# EAGLE design 1Sens+lowPass (EAGLE 6.4)
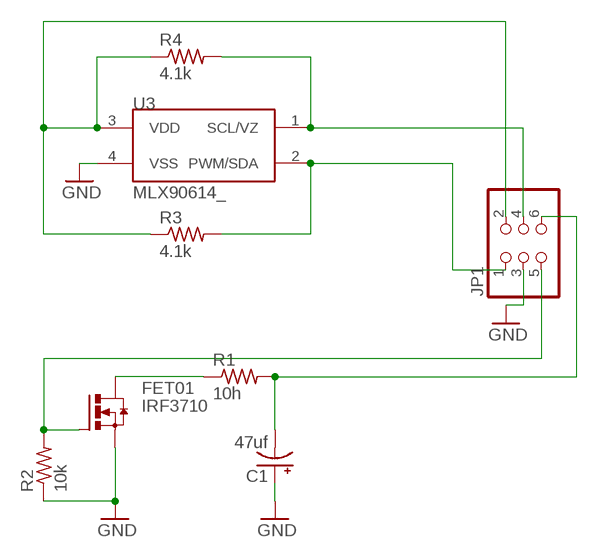
[diagram p0: schematic, sheet 1]

## Parts
C1  47uf  CPOL-USE2,5-6E  [E2,5-6E]
FET01  IRF3710  IRF3704  [TO220AH]
JP1  PINHD-2X3  [2X03]
R1  10h  R-US_0207/7  [0207/7]
R2  10k  R-US_0207/7  [0207/7]
R3  4.1k  R-US_0204/5  [0204/5]
R4  4.1k  R-US_0204/5  [0204/5]
U3  MLX90614_  [TO-39]

## Nets
GND: C1.+ FET01.E(S) JP1.3 R2.1 U3.4(VSS)
N$1: JP1.2 R3.1 R4.1 U3.3(VDD)
N$2: FET01.C(D) R1.1
N$11: C1.- JP1.6 R1.2
N$15: JP1.4 R4.2 U3.1(SCL/VZ)
N$16: JP1.1 R3.2 U3.2(PWM/SDA)
N$18: FET01.B(G) JP1.5 R2.2

## Library data of the parts
C1 = rcl:CPOL-US: POLARIZED CAPACITOR, American symbol
FET01 = transistor-power:IRF3704: SMPS MOSFET HEXFET® Power MOSFET Source: http://www.irf.com/product-info/datasheets/data/irf3704.pdf
JP1 = SparkFun-Connectors:PINHD-2X3: PIN HEADER
R1-R4 = rcl:R-US_: RESISTOR, American symbol
U3 = SparkFun-Sensors:MLX90614: Non-contact PIR I2C interface temperature sensor

## Board
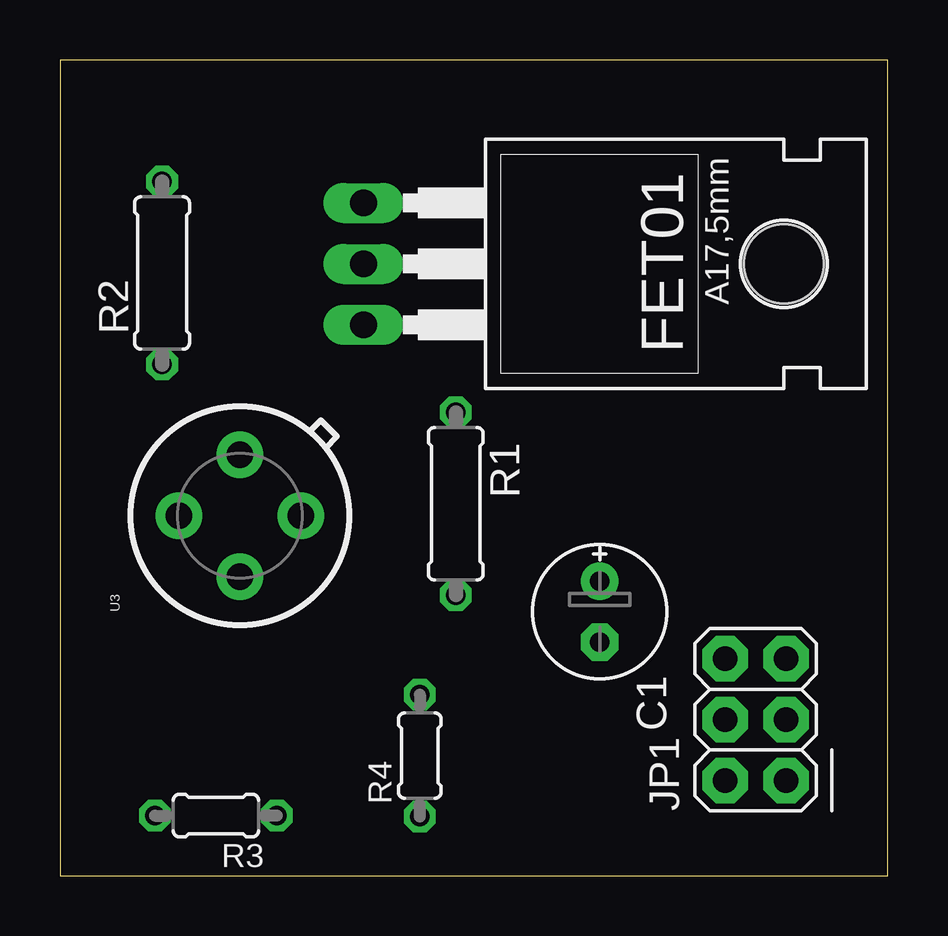
[diagram p1: board, top side]
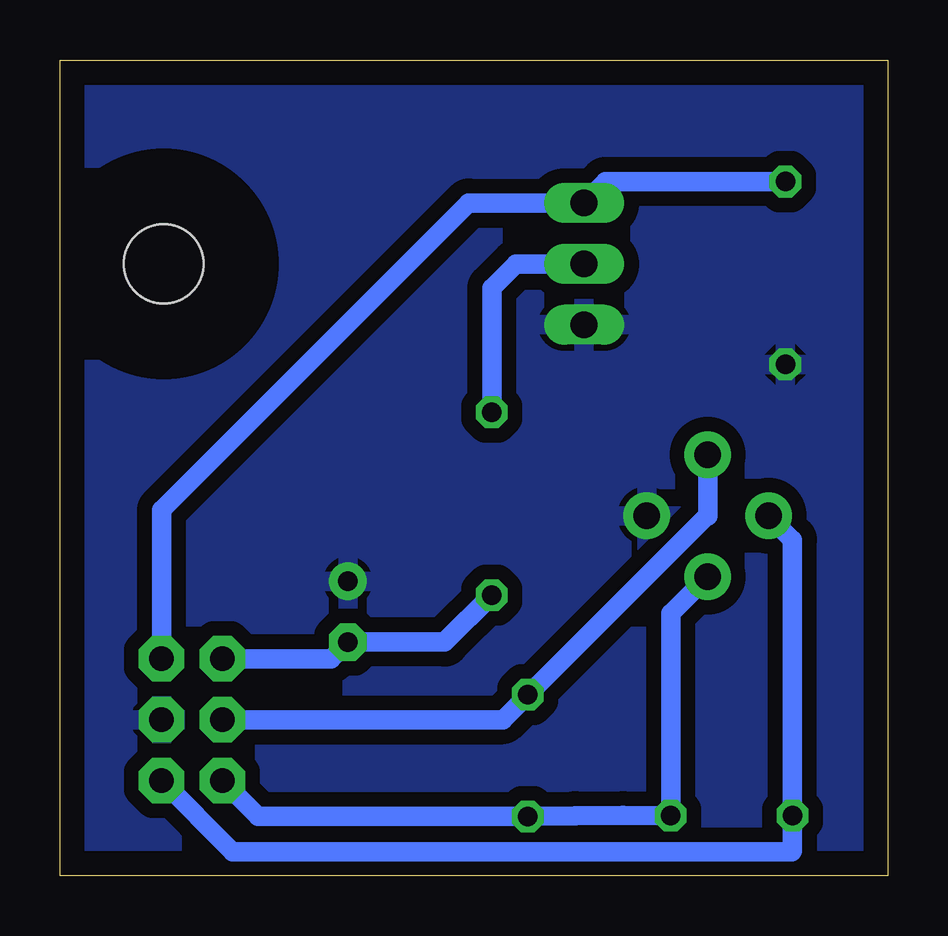
[diagram p2: board, bottom side, seen from below]

Size 34.5 x 34 mm. Coordinates in mm from the lower left corner, seen from the top.
Outline: 0,0 34.5,0 34.5,34 0,34 0,0
Copper layers (1*16): Top 0.035mm / dielectric 1.5mm / Bottom 0.035mm
Design rules "default": minimum track width 10mil, minimum drill 24mil, track to track 8mil, track to pad 8mil, pad to pad 8mil, via to via 8mil, smd to smd 8mil, copper to edge 40mil, drill to drill 8mil, minimum pad ring 10mil, minimum via ring 8mil, stop-mask expansion 4mil, vias tented up to drill 0mil, thermal gap 10mil

### Footprints (pad centres in the part's own frame; a part is rotated, then mirrored left to right if it is on the bottom)
E2,5-6E = drill 0.813 pad 1.575: + -1.27,0 | drill 0.813 pad 1.575 octagon: - 1.27,0
TO220AH = drill 1.118 long: B -2.54,-6.35; C 0,-6.35; E 2.54,-6.35 | hole 3.302: 0,11.176
2X03 = drill 1.016 pad 1.88 octagon: 1 -2.54,-1.27; 2 -2.54,1.27; 3 0,-1.27; 4 0,1.27; 5 2.54,-1.27; 6 2.54,1.27
0207/7 = drill 0.813 octagon: 1 -3.81,0; 2 3.81,0
0204/5 = drill 0.813 octagon: 1 -2.54,0; 2 2.54,0
TO-39 = drill 1.1 pad 1.93: 1 2.54,0; 2 0,2.54; 3 -2.54,0; 4 0,-2.54

### Placement (x,y rotation side)
C1  22.5,11 270 top
FET01  19,25.5 270 top
JP1  29,6.5 90 top
R1  16.5,15.5 270 top
R2  4.26,25.12 90 top
R3  6.5,2.5 180 top
R4  15,5 90 top
U3  7.5,15 90 top

### Tracks (layer width: path | path; a pad name or v marks a point on that pad's centre or on a via)
GND
  pour Bottom (isolate 0.61): 0,34 34.5,34 34.5,0 0,0
N$1
  Bottom 0.813: U3.3 9.04,10.92 R3.1 arc-2 R4.1 26.23,2.46 JP1.2
N$2
  Bottom 0.813: R1.1 16.5,24.5 15.5,25.5 FET01.C
N$11
  Bottom 0.813: R1.2 18.46,9.73 C1.- 23.19,9.04 JP1.6
N$15
  Bottom 0.813: U3.1 7.5,15 7.54,15 R4.2 16.04,6.5 JP1.4
N$16
  Bottom 0.813: U3.2 3.96,14 R3.2 3.96,1.04 4,1 27.31,1 JP1.1
N$18
  Bottom 0.813: R2.2 11.76,28.93 FET01.B 17.46,28.04 30.27,15.23 JP1.5

### Text on the board
tTEXT: ioio / pin | vib | scl | GND | VCC ioio | SDA